# Altium schematic sheet Pulser_Top.SchDoc
size A; SheetNumber: 1; SheetTotal: 4
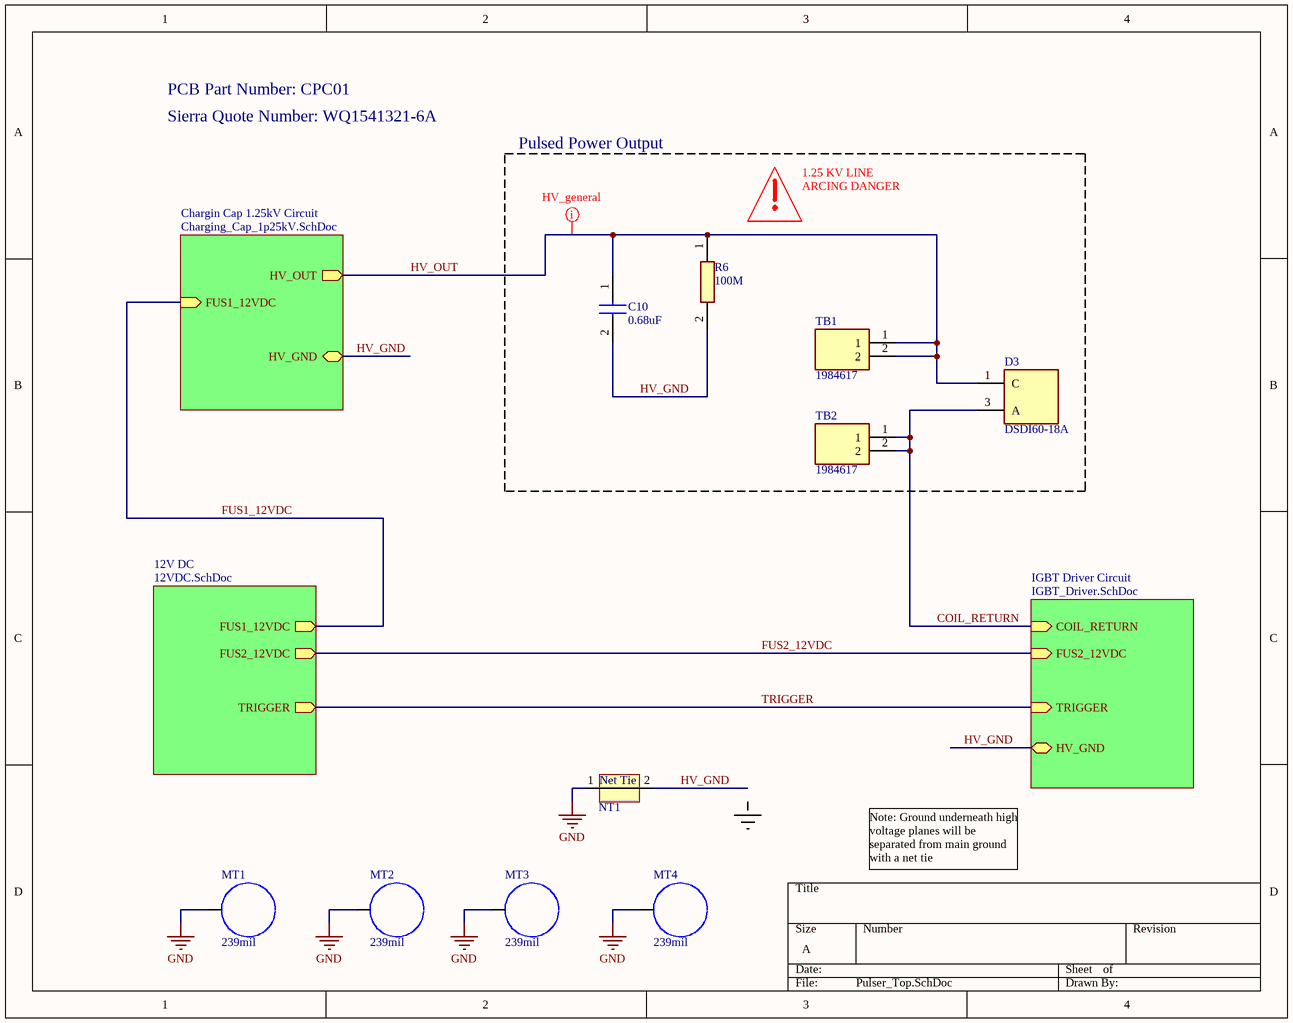
[diagram p0: Pulser_Top.SchDoc]

## Parts
C10  0.68uF  [MKP1839468134HQ]
D3  DSDI60-18A  [TO546P530X1586X2594-2P]
MT1  239mil  [MTHOLE_239mil]
MT2  239mil  [MTHOLE_239mil]
MT3  239mil  [MTHOLE_239mil]
MT4  239mil  [MTHOLE_239mil]
NT1  Net tie 50mil  [NET_TIE_50mil]  (value not drawn)  (net tie, no BOM)
R6  100M  [HB3100MFZRE]
TB1  1984617  [1984617]
TB2  1984617  [1984617]

## Blocks framed on the sheet
Pulsed Power Output: C10 D3 R6 TB1 TB2

## Sub-sheets
12V DC = 12VDC.SchDoc: TRIGGER (out), FUS2_12VDC (out), FUS1_12VDC (out)
Chargin Cap 1.25kV Circuit = Charging_Cap_1p25kV.SchDoc: HV_OUT (out), FUS1_12VDC (in), HV_GND (bidir)
IGBT Driver Circuit = IGBT_Driver.SchDoc: COIL_RETURN (in), TRIGGER (in), FUS2_12VDC (in), HV_GND (bidir)

## Nets
GND: MT1.1 MT2.1 MT3.1 MT4.1 NT1.1
COIL_RETURN: D3.3(A) TB2.1 TB2.2 ; sheet IGBT Driver Circuit/COIL_RETURN
FUS1_12VDC: sheet Chargin Cap 1.25kV Circuit/FUS1_12VDC, sheet 12V DC/FUS1_12VDC
FUS2_12VDC: sheet 12V DC/FUS2_12VDC, sheet IGBT Driver Circuit/FUS2_12VDC
HV_GND: C10.2 NT1.2 R6.2 ; sheet Chargin Cap 1.25kV Circuit/HV_GND, sheet IGBT Driver Circuit/HV_GND
HV_OUT: C10.1 D3.1(C) R6.1 TB1.1 TB1.2 ; sheet Chargin Cap 1.25kV Circuit/HV_OUT
TRIGGER: sheet 12V DC/TRIGGER, sheet IGBT Driver Circuit/TRIGGER

## Layout directives
net class HV_general: HV_OUT

## Notes on the sheet
- PCB Part Number: CPC01
- Sierra Quote Number: WQ1541321-6A
- 1.25 KV LINE
- ARCING DANGER
- Note: Ground underneath high voltage planes will be separated from main ground with a net tie
- (in symbol NET_TIE_50mil) Net Tie

## Library data of the parts
C10 = MKP1839468134HQ: Capacitor MKP1839468134HQ; Manufacturer_Name: Vishay; Datasheet Link: https://www.vishay.com/docs/28162/mkp1839hq.pdf; Height: 28mm; Manufacturer_Part_Number: MKP1839468134HQ; Mouser Part Number: 75-MKP1839468134HQ; Mouser Price/Stock: https://www.mouser.com/Search/Refine.aspx?Keyword=75-MKP1839468134HQ
D3 = DSDI60-18A: Diode; Manufacturer_Name: LITTELFUSE; Datasheet Link: http://ixapps.ixys.com/DataSheet/96517.pdf; Height: 5.3mm; Manufacturer_Part_Number: DSDI60-18A
MT1-MT4 = MTHOLE_239MIL: Manufacturer Part Number: (NULL); Part Number: MTHOLE_239; Manufacturer: (NULL)
NT1 = NET_TIE_50mil
R6 = HB3100MFZRE: Resistor; Manufacturer_Name: TE Connectivity; Datasheet Link: http://www.te.com/commerce/DocumentDelivery/DDEController?Action=srchrtrv&DocNm=1773310&DocType=DS&DocLang=English; Manufacturer_Part_Number: HB3100MFZRE
TB1 TB2 = 1984617: Connector; Manufacturer_Name: Phoenix Contact; Datasheet Link: https://datasheet.datasheetarchive.com/originals/distributors/Datasheets-DGA17/1074867.pdf; Height: 9.3mm; Manufacturer_Part_Number: 1984617; Mouser Part Number: 651-1984617; Mouser Price/Stock: https://www.mouser.co.uk/ProductDetail/Phoenix-Contact/1984617?qs=ATjOrvm3mOhUrGlJQoUcpQ%3D%3D; Arrow Part Number: 1984617; Arrow Price/Stock: https://www.arrow.com/en/products/1984617/phoenix-contact?region=nac